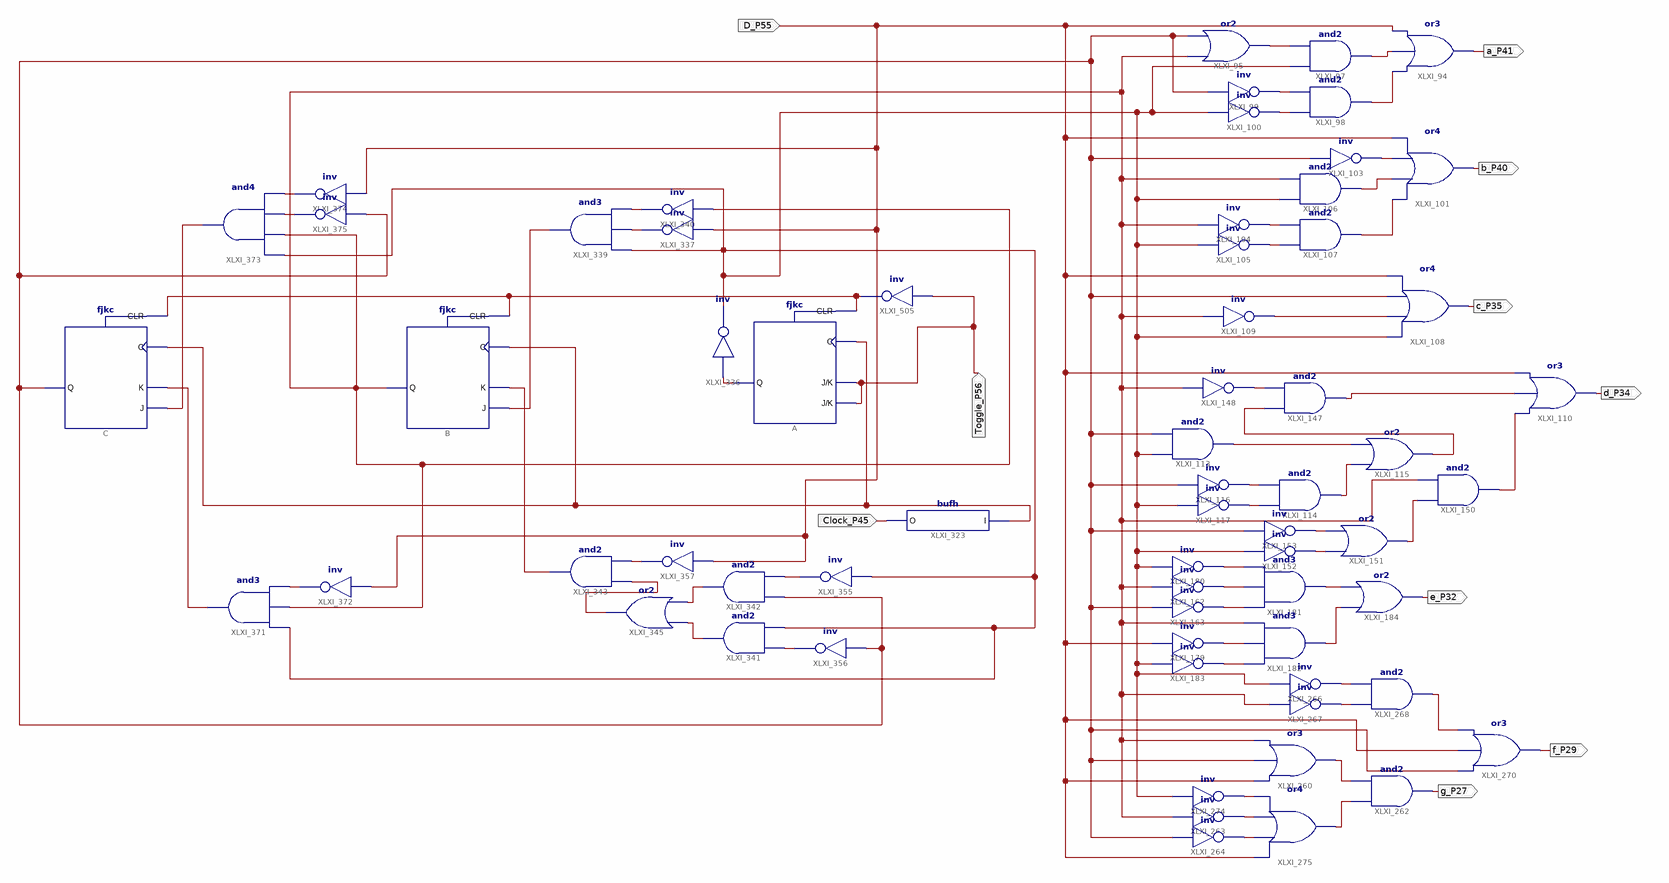
[diagram p0: schematic sheet 1]
// Xilinx ISE schematic Lab05.sch (spartan6) as structural Verilog: 65 symbols, 10 ports
module Lab05 (
  input  Clock_P45,
  input  D_P55,
  input  Toggle_P56,
  output a_P41,
  output b_P40,
  output c_P35,
  output e_P32,
  output d_P34,
  output g_P27,
  output f_P29
);

  wire A_P58, B_P57, C_P56, XLXN_234, XLXN_238, XLXN_241, XLXN_242, XLXN_243, XLXN_249, XLXN_250, XLXN_251,
       XLXN_253, XLXN_254, XLXN_263, XLXN_277, XLXN_278, XLXN_279, XLXN_293, XLXN_320, XLXN_322, XLXN_323,
       XLXN_328, XLXN_329, XLXN_330, XLXN_333, XLXN_380, XLXN_381, XLXN_382, XLXN_383, XLXN_384, XLXN_386,
       XLXN_387, XLXN_513, XLXN_514, XLXN_519, XLXN_520, XLXN_532, XLXN_533, XLXN_536, XLXN_545, XLXN_603,
       XLXN_622, XLXN_630, XLXN_633, XLXN_644, XLXN_645, XLXN_646, XLXN_647, XLXN_650, XLXN_659, XLXN_664,
       XLXN_665, XLXN_666, XLXN_671, XLXN_672, XLXN_673, XLXN_674, XLXN_854;

  or XLXI_94 (a_P41, XLXN_241, XLXN_234, D_P55);
  or XLXI_95 (XLXN_238, B_P57, C_P56);
  and XLXI_97 (XLXN_234, A_P58, XLXN_238);
  and XLXI_98 (XLXN_241, XLXN_243, XLXN_242);
  not XLXI_99 (XLXN_242, C_P56);
  not XLXI_100 (XLXN_243, A_P58);
  or XLXI_101 (b_P40, XLXN_251, XLXN_250, XLXN_249, D_P55);
  not XLXI_103 (XLXN_249, C_P56);
  and XLXI_106 (XLXN_250, A_P58, B_P57);
  and XLXI_107 (XLXN_251, XLXN_253, XLXN_254);
  not XLXI_105 (XLXN_253, A_P58);
  not XLXI_104 (XLXN_254, B_P57);
  not XLXI_109 (XLXN_263, B_P57);
  or XLXI_108 (c_P35, A_P58, XLXN_263, C_P56, D_P55);
  or XLXI_115 (XLXN_322, XLXN_293, XLXN_277);
  not XLXI_116 (XLXN_278, C_P56);
  and XLXI_114 (XLXN_293, XLXN_279, XLXN_278);
  and XLXI_113 (XLXN_277, A_P58, C_P56);
  and XLXI_147 (XLXN_323, XLXN_322, XLXN_320);
  not XLXI_148 (XLXN_320, B_P57);
  or XLXI_110 (d_P34, XLXN_333, XLXN_323, D_P55);
  and XLXI_150 (XLXN_333, XLXN_330, B_P57);
  or XLXI_151 (XLXN_330, XLXN_328, XLXN_329);
  not XLXI_117 (XLXN_279, A_P58);
  not XLXI_153 (XLXN_329, C_P56);
  not XLXI_152 (XLXN_328, A_P58);
  not XLXI_180 (XLXN_382, A_P58);
  not XLXI_162 (XLXN_381, B_P57);
  not XLXI_163 (XLXN_380, C_P56);
  and XLXI_181 (XLXN_386, XLXN_380, XLXN_381, XLXN_382);
  or XLXI_184 (e_P32, XLXN_387, XLXN_386);
  not XLXI_183 (XLXN_384, A_P58);
  not XLXI_179 (XLXN_383, D_P55);
  or XLXI_260 (XLXN_513, D_P55, C_P56, B_P57);
  and XLXI_262 (g_P27, XLXN_514, XLXN_513);
  not XLXI_263 (XLXN_519, B_P57);
  not XLXI_264 (XLXN_520, C_P56);
  and XLXI_268 (XLXN_536, XLXN_532, XLXN_533);
  and XLXI_182 (XLXN_387, XLXN_384, XLXN_383, B_P57);
  not XLXI_267 (XLXN_532, B_P57);
  not XLXI_266 (XLXN_533, A_P58);
  or XLXI_270 (f_P29, C_P56, D_P55, XLXN_536);
  not XLXI_274 (XLXN_545, A_P58);
  or XLXI_275 (XLXN_514, D_P55, XLXN_520, XLXN_519, XLXN_545);
  fjkc A (.C(XLXN_603), .CLR(XLXN_854), .J(Toggle_P56), .K(Toggle_P56), .Q(XLXN_622));
  fjkc B (.C(XLXN_603), .CLR(XLXN_854), .J(XLXN_672), .K(XLXN_673), .Q(B_P57));
  fjkc C (.C(XLXN_603), .CLR(XLXN_854), .J(XLXN_671), .K(XLXN_674), .Q(C_P56));
  not XLXI_336 (A_P58, XLXN_622);
  not XLXI_337 (XLXN_630, D_P55);
  and XLXI_339 (XLXN_672, XLXN_633, XLXN_630, A_P58);
  not XLXI_340 (XLXN_633, B_P57);
  bufh XLXI_323 (.I(XLXN_603), .O(Clock_P45));
  not XLXI_356 (XLXN_645, C_P56);
  and XLXI_341 (XLXN_650, A_P58, XLXN_645);
  and XLXI_342 (XLXN_647, XLXN_644, C_P56);
  or XLXI_345 (XLXN_659, XLXN_647, XLXN_650);
  not XLXI_357 (XLXN_646, D_P55);
  and XLXI_343 (XLXN_673, XLXN_646, XLXN_659);
  not XLXI_355 (XLXN_644, A_P58);
  and XLXI_371 (XLXN_674, XLXN_664, B_P57, A_P58);
  not XLXI_372 (XLXN_664, D_P55);
  and XLXI_373 (XLXN_671, XLXN_665, XLXN_666, B_P57, A_P58);
  not XLXI_374 (XLXN_665, D_P55);
  not XLXI_375 (XLXN_666, C_P56);
  not XLXI_505 (XLXN_854, Toggle_P56);
endmodule
